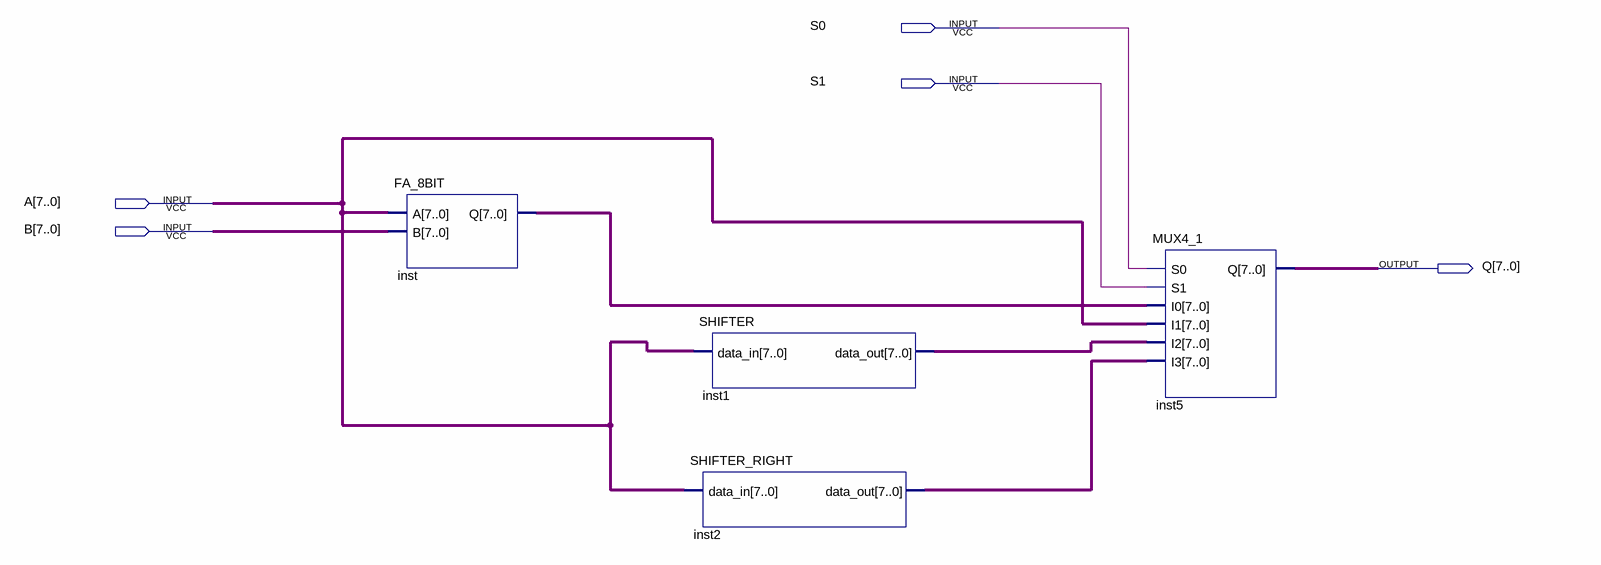
[diagram p0: schematic sheet]
// Quartus schematic ALU.bdf as structural Verilog: 4 symbols, 5 pins
module ALU (
  input  S0,
  input  S1,
  input  [7:0] A,
  input  [7:0] B,
  output [7:0] Q
);

  wire [7:0] inst1_data_out, inst2_data_out, inst_q;

  FA_8BIT inst (.A(A), .B(B), .Q(inst_q));
  SHIFTER_RIGHT inst2 (.data_in(A), .data_out(inst2_data_out));
  SHIFTER inst1 (.data_in(A), .data_out(inst1_data_out));
  MUX4_1 inst5 (.S0(S0), .S1(S1), .I0(inst_q), .I1(A), .I2(inst1_data_out), .I3(inst2_data_out), .Q(Q));
endmodule
